# Altium project PCB_Project2.PrjPCB
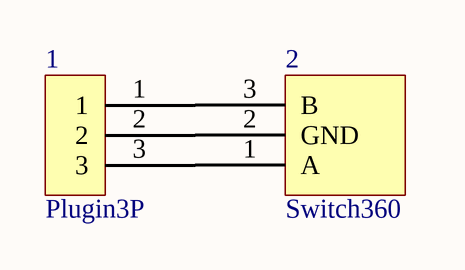
[diagram p0: Sheet2.SchDoc]
1 sheet, 2 parts. Net scope: global (net labels, ports and power ports of the same name join across sheets).
Board file: PCB2.PcbDoc

## Sheet Sheet2.SchDoc
size A4

### Parts
1  Plugin3P  [Plugin3P]
2  Switch360  [Switch360]

### Nets
Net1_1: 1.1 2.3(B)
Net1_2: 1.2 2.2(GND)
Net1_3: 1.3 2.1(A)